# EAGLE schematic Smart_Lamp_v0.1 (EAGLE 7.7.0)
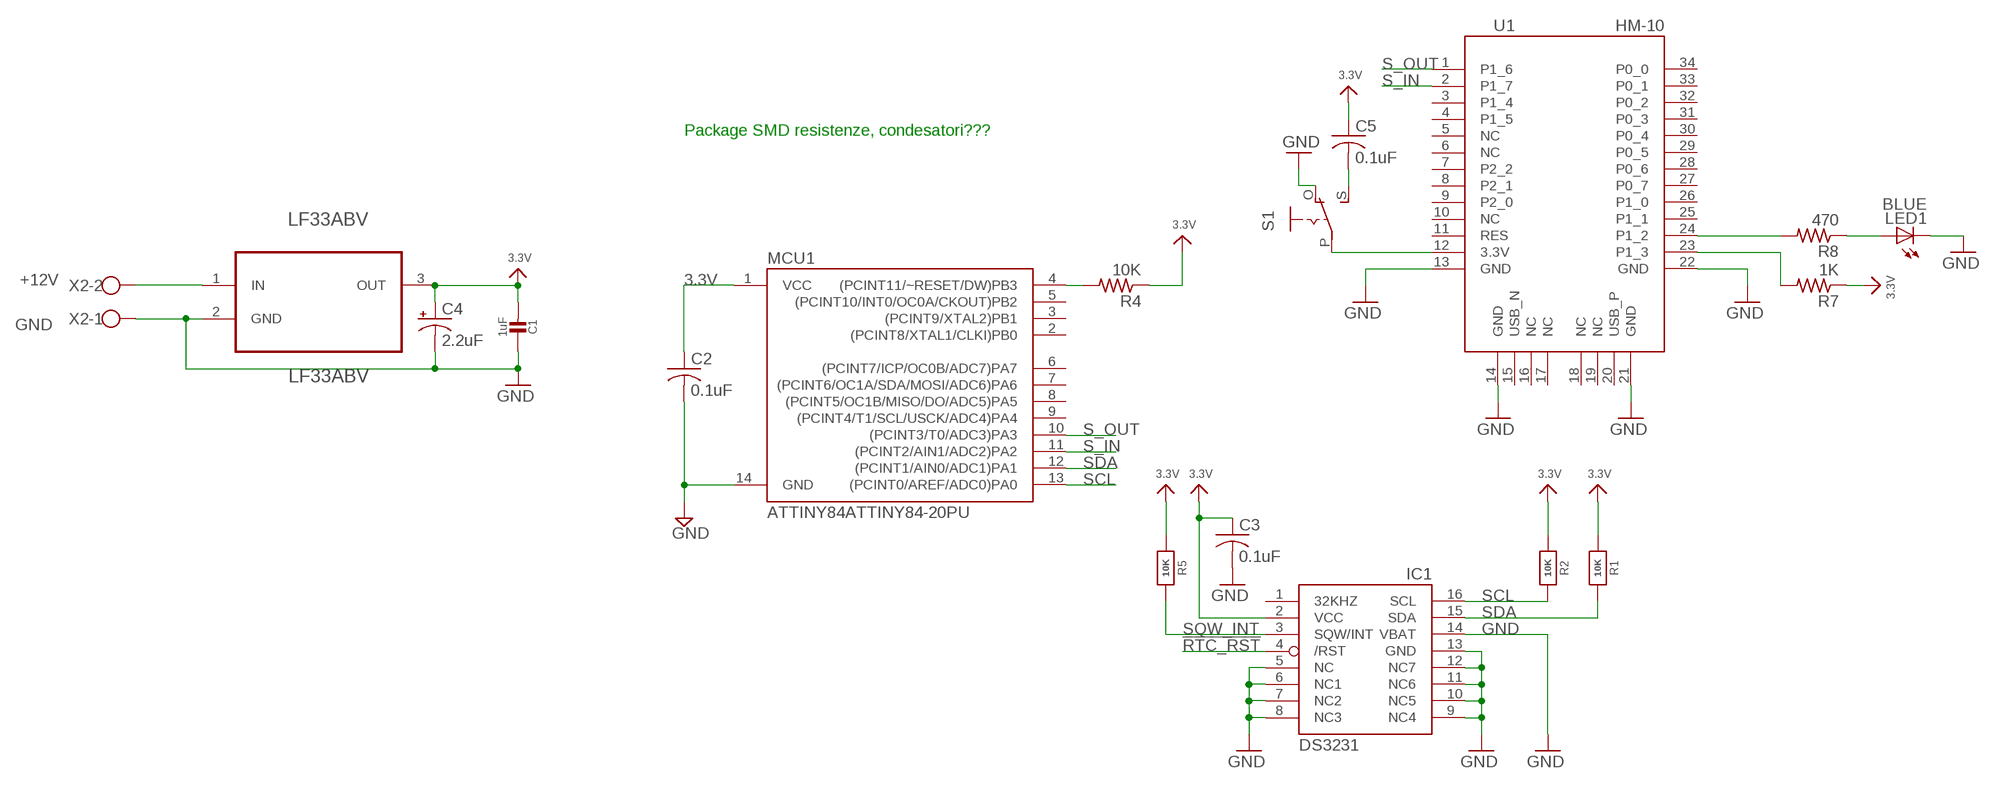
[diagram p0: schematic, sheet 1]

## Parts
C1  1uF  CAP_CERAMIC0805-NOOUTLINE  [0805-NO]
C2  0.1uF  C-US025-024X044  [C025-024X044]
C3  0.1uF  C-USC0805  [C0805]
C4  2.2uF  CAP_POLPTH2  [CPOL-RADIAL-10UF-25V]
C5  0.1uF  C-US025-024X044  [C025-024X044]
IC1  DS3231/SO  [SO16W]
LED1  BLUE  LED3MM  [LED3MM]
LF33ABV  LF33ABV  [TO254P450X1020X1935-3P]
MCU1  ATTINY84ATTINY84-20PU  [DIL14]
R1  10K  RESISTOR0805_NOOUTLINE  [0805-NO]
R2  10K  RESISTOR0805_NOOUTLINE  [0805-NO]
R4  10K  R-US_0207/10  [0207/10]
R5  10K  RESISTOR0805_NOOUTLINE  [0805-NO]
R7  1K  R-US_0207/10  [0207/10]
R8  470  R-US_0207/10  [0207/10]
S1  EG1218S  [EG1218]
U1  HM-10  [HM-10]
X2  W237-102  [W237-102]

## Nets
3.3V: C1.2 C2.1 C3.1 C4.1(+) C5.1 IC1.2(VCC) LF33ABV.3(OUT) MCU1.1(VCC) R1.1 R2.1 R4.1 R5.1 R7.1
!RTC_RST: IC1.4(/RST)
+12V [power]: LF33ABV.1(IN) X2.2
GND: C1.1 C2.2 C3.2 C4.2(-) IC1.5(NC) IC1.6(NC1) IC1.7(NC2) IC1.8(NC3) IC1.9(NC4) IC1.10(NC5) IC1.11(NC6) IC1.12(NC7) IC1.13(GND) IC1.14(VBAT) LED1.K(C) LF33ABV.2(GND) MCU1.14(GND) S1.O U1.13(GND) U1.14(GND) U1.21(GND) U1.22(GND) X2.1
N$1: S1.P U1.12(3.3V)
N$2: C5.2 S1.S
N$5: MCU1.4((PCINT11/~RESET/DW)PB3) R4.2
N$9: R8.2 U1.24(P1_2)
N$10: LED1.A R8.1
N$12: R7.2 U1.23(P1_3)
S_IN: MCU1.11((PCINT2/AIN1/ADC2)PA2) U1.2(P1_7)
S_OUT: MCU1.10((PCINT3/T0/ADC3)PA3) U1.1(P1_6)
SCL: IC1.16(SCL) MCU1.13((PCINT0/AREF/ADC0)PA0) R2.2
SDA: IC1.15(SDA) MCU1.12((PCINT1/AIN0/ADC1)PA1) R1.2
SQW_INT: IC1.3(SQW/INT) R5.2
Unconnected: IC1.1(32KHZ) MCU1.2((PCINT8/XTAL1/CLKI)PB0) MCU1.3((PCINT9/XTAL2)PB1) MCU1.5((PCINT10/INT0/OC0A/CKOUT)PB2) MCU1.6((PCINT7/ICP/OC0B/ADC7)PA7) MCU1.7((PCINT6/OC1A/SDA/MOSI/ADC6)PA6) MCU1.8((PCINT5/OC1B/MISO/DO/ADC5)PA5) MCU1.9((PCINT4/T1/SCL/USCK/ADC4)PA4) U1.3(P1_4) U1.4(P1_5) U1.5(NC) U1.6(NC) U1.7(P2_2) U1.8(P2_1) U1.9(P2_0) U1.10(NC) U1.11(RES) U1.15(USB_N) U1.16(NC) U1.17(NC) U1.18(NC) U1.19(NC) U1.20(USB_P) U1.25(P1_1) U1.26(P1_0) U1.27(P0_7) U1.28(P0_6) U1.29(P0_5) U1.30(P0_4) U1.31(P0_3) U1.32(P0_2) U1.33(P0_1) U1.34(P0_0)

## Notes on the sheet
- Package SMD resistenze, condesatori???

## Library data of the parts
C1 = microbuilder:CAP_CERAMIC: Ceramic Capacitors For new designs, use the packages preceded by an '_' character since they are more reliable: The following footprints should be used on most boards: _0402 - Standard footprint for regular board layouts _0603 - Standard footprint for regular board layouts _0805 - Standard footprint for regular board layouts _1206 - Standard footprint for regular board layouts For extremely tight-pitch boards where space is at a premium, the following 'micro-pitch' footprints can be used (smaller pads, no silkscreen outline, etc.): _0402MP - Micro-pitch footprint for very dense/compact boards _0603MP - Micro-pitch footprint for very dense/compact boards _0805MP - Micro-pitch footprint for very dense/compact boards _1206MP - Micro-pitch footprint for very dense/compact boards
C2 C3 C5 = adafruit:C-US: CAPACITOR, American symbol
C4 = SparkFun-Capacitors:CAP_POL: Capacitor Polarized These are standard SMD and PTH capacitors. Normally 10uF, 47uF, and 100uF in electrolytic and tantalum varieties. Always verify the external diameter of the through hole cap, it varies with capacity, voltage, and manufacturer. The EIA devices should be standard.
IC1 = adafruit:DS3231
LED1 = adafruit:LED: LED OSRAM: - CHIPLED LG R971, LG N971, LY N971, LG Q971, LY Q971, LO R971, LY R971 LH N974, LH R974 LS Q976, LO Q976, LY Q976 LO Q996 - Hyper CHIPLED LW Q18S LB Q993, LB Q99A, LB R99A - SideLED LS A670, LO A670, LY A670, LG A670, LP A670 LB A673, LV A673, LT A673, LW A673 LH A674 LY A675 LS A676, LA A676, LO A676, LY A676, LW A676 LS A679, LY A679, LG A679 - Hyper Micro SIDELED® LS Y876, LA Y876, LO Y876, LY Y876 LT Y87S - SmartLED LW L88C, LW L88S LB L89C, LB L89S, LG L890 LS L89K, LO L89K, LY L89K LS L896, LA L896, LO L896, LY L896 - TOPLED LS T670, LO T670, LY T670, LG T670, LP T670 LSG T670, LSP T670, LSY T670, LOP T670, LYG T670 LG T671, LOG T671, LSG T671 LB T673, LV T673, LT T673, LW T673 LH T674 LS T676, LA T676, LO T676, LY T676, LB T676, LH T676, LSB T676, LW T676 LB T67C, LV T67C, LT T67C, LS T67K, LO T67K, LY T67K, LW E67C LS E67B, LA E67B, LO E67B, LY E67B, LB E67C, LV E67C, LT E67C LW T67C LS T679, LY T679, LG T679 LS T770, LO T770, LY T770, LG T770, LP T770 LB T773, LV T773, LT T773, LW T773 LH T774 LS E675, LA E675, LY E675, LS T675 LS T776, LA T776, LO T776, LY T776, LB T776 LHGB T686 LT T68C, LB T68C - Hyper Mini TOPLED® LB M676 - Mini TOPLED Santana® LG M470 LS M47K, LO M47K, LY M47K Source: http://www.osram.convergy.de/
LF33ABV = ST Microelctronics_By_element14_Batch_1:LF33ABV: Very low drop voltage regulators with inhibit; MPN: LF33ABV; OC_FARNELL: 1087184; OC_NEWARK: 26M0228; PACKAGE: TO-220; SUPPLIER: STMicroelectronics
MCU1 = SparkFun-DigitalIC:ATTINY84: Atmel 14-pin 2/4/8kB flash uC
R1 R2 R5 = microbuilder:RESISTOR: Resistors For new designs, use the packages preceded by an '_' character since they are more reliable: The following footprints should be used on most boards: _0402 - Standard footprint for regular board layouts _0603 - Standard footprint for regular board layouts _0805 - Standard footprint for regular board layouts _1206 - Standard footprint for regular board layouts For extremely tight-pitch boards where space is at a premium, the following 'micro-pitch' footprints can be used (smaller pads, no silkscreen outline, etc.): _0402MP - Micro-pitch footprint for very dense/compact boards _0603MP - Micro-pitch footprint for very dense/compact boards _0805MP - Micro-pitch footprint for very dense/compact boards _1206MP - Micro-pitch footprint for very dense/compact boards
R4 R7 R8 = rcl:R-US_: RESISTOR, American symbol
S1 = adafruit:EG1218: SLIDING SWITCH 0.1" spacing through hole, vertical SPDT slide switch http://www.ladyada.net/library/pcb/eaglelibrary.html
U1 = HM-10_BLE:HM-10
X2 = con-wago-500:W237-102: WAGO SCREW CLAMP; MPN: 237-102; OC_FARNELL: unknown; OC_NEWARK: 70K9898

## Net classes
1 power: width 0.635 mm, drill 0.508 mm, clearance 0.559 mm